# EAGLE design logicBlocks-AND (EAGLE 6.2)
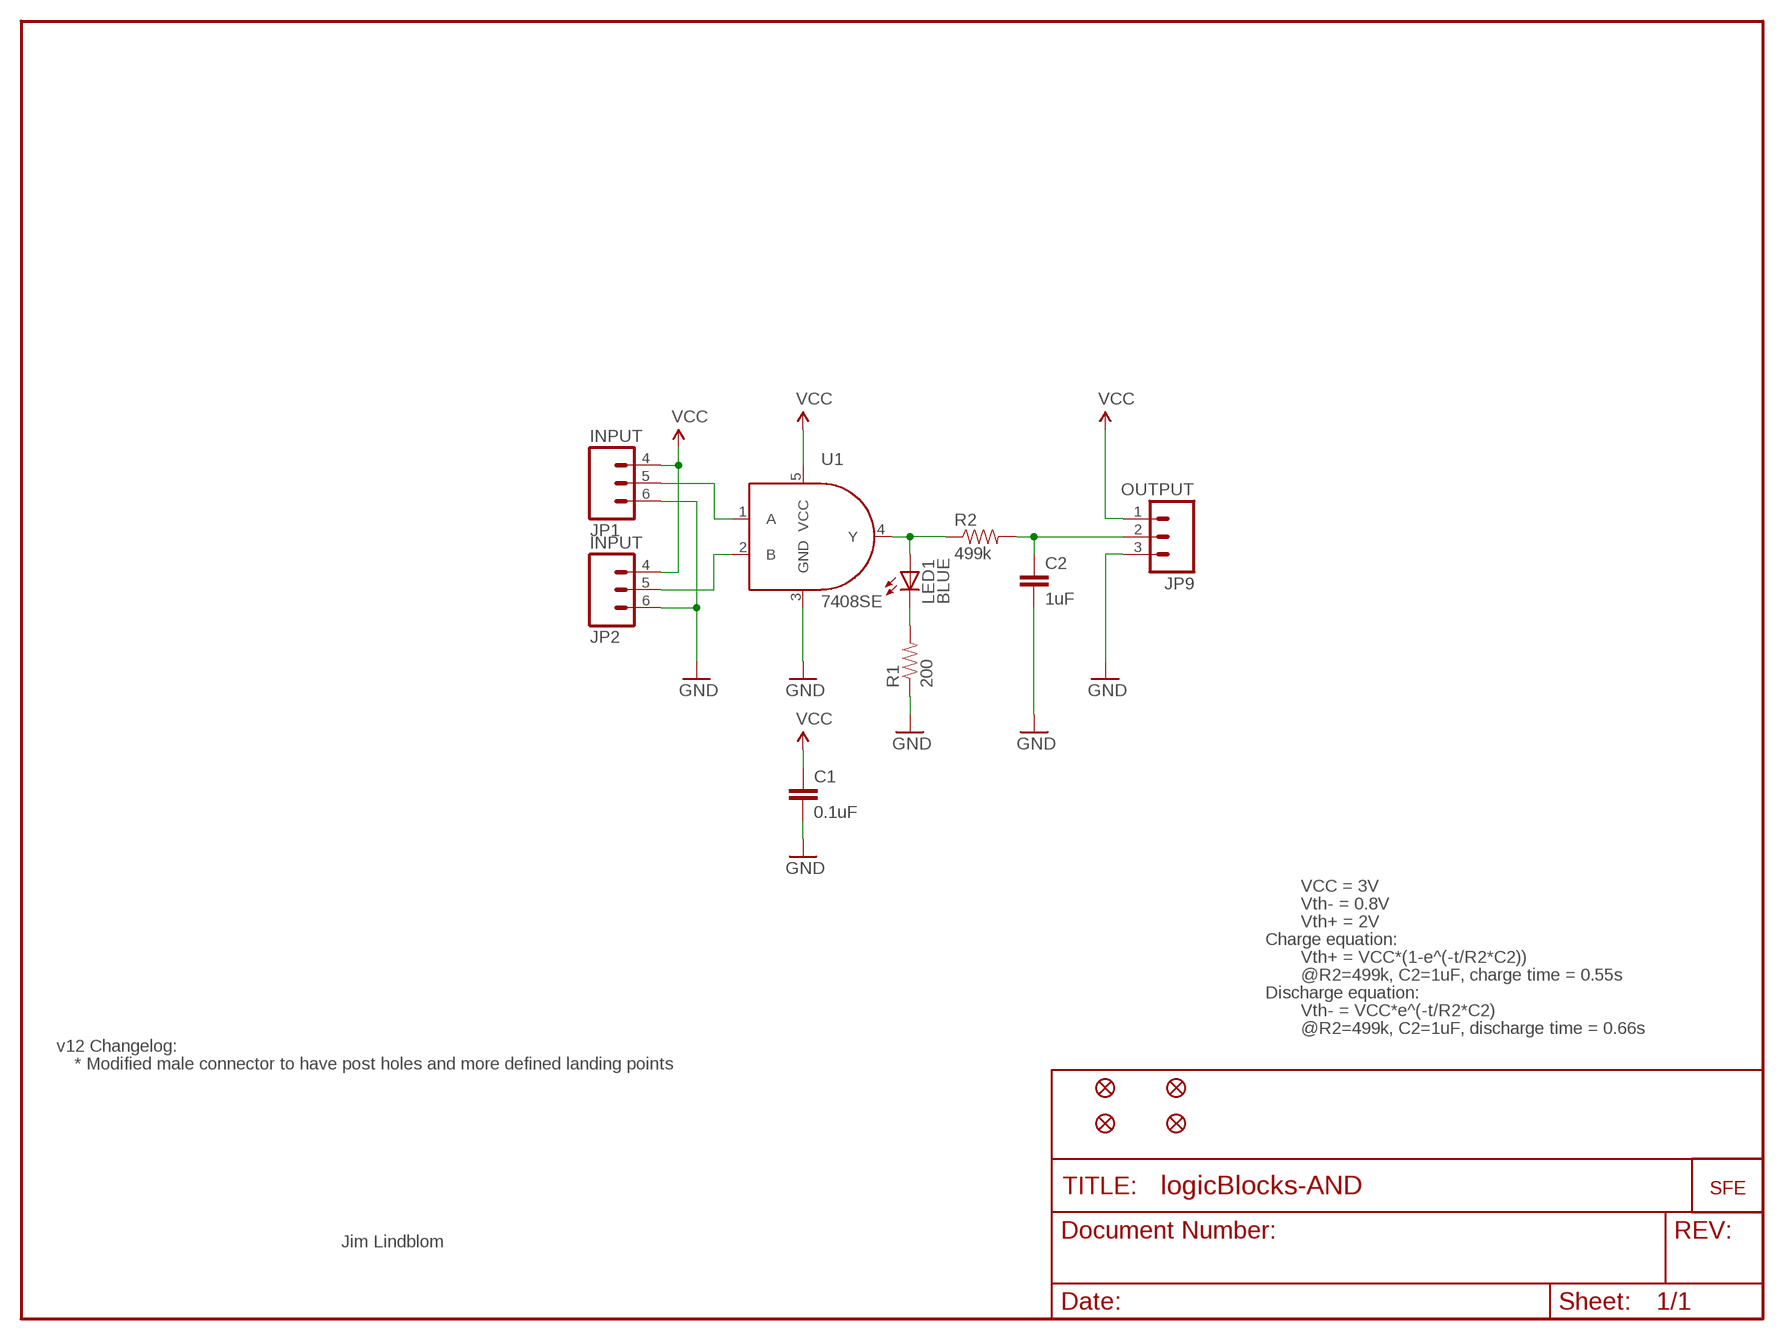
[diagram p0: schematic, sheet 1]

## Parts
C1  0.1uF  CAP0402-CAP  [0402-CAP]
C2  1uF  CAP0402-CAP  [0402-CAP]
JP1  INPUT  M03SMD-RA-FEMALE  [1X03-SMD-FEMALE]
JP2  INPUT  M03SMD-RA-FEMALE  [1X03-SMD-FEMALE]
JP4  FIDUCIALUFIDUCIAL  [MICRO-FIDUCIAL]
JP5  LOGO-SFESK  [SFE-LOGO-FLAME]
JP6  FIDUCIALUFIDUCIAL  [MICRO-FIDUCIAL]
JP7  FIDUCIALUFIDUCIAL  [MICRO-FIDUCIAL]
JP8  FIDUCIALUFIDUCIAL  [MICRO-FIDUCIAL]
JP9  OUTPUT  M03SMD_RA_MALE_POST  [1X03_SMD_RA_MALE_POST]
LED1  BLUE  LED1206  [LED-1206]
R1  200  RESISTOR0402-RES  [0402-RES]
R2  499k  RESISTOR0402-RES  [0402-RES]
U1  7408SE  [SOT353]

## Nets
GND: C1.2 C2.2 JP1.6 JP2.6 JP9.3 R1.1 U1.3(GND)
N$1: JP1.5 U1.1(A)
N$2: JP2.5 U1.2(B)
N$3: C2.1 JP9.2 R2.2
N$4: LED1.A R2.1 U1.4(Y)
N$5: LED1.C R1.2
VCC: C1.1 JP1.4 JP2.4 JP9.1 U1.5(VCC)

## Notes on the sheet
- VCC = 3V
- Vth- = 0.8V
- Vth+ = 2V
- Charge equation:
- Vth+ = VCC*(1-e^(-t/R2*C2))
- @R2=499k, C2=1uF, charge time = 0.55s
- Discharge equation:
- Vth- = VCC*e^(-t/R2*C2)
- @R2=499k, C2=1uF, discharge time = 0.66s
- v12 Changelog:
- * Modified male connector to have post holes and more defined landing points
- Jim Lindblom

## Library data of the parts
C1 C2 = SparkFun:CAP: Capacitor Standard 0603 ceramic capacitor, and 0.1" leaded capacitor.
JP1 JP2 = SparkFun:M03: Header 3 Standard 3-pin 0.1" header. Use with straight break away headers (SKU : PRT-00116), right angle break away headers (PRT-00553), swiss pins (PRT-00743), machine pins (PRT-00117), and female headers (PRT-00115). Molex polarized connector foot print use with SKU : PRT-08232 with associated crimp pins and housings.
JP4 JP6-JP8 = SparkFun:FIDUCIAL: Fiducial Alignment Points Various fiducial points for machine vision alignment.
JP5 = SparkFun:LOGO-SFE: Spark Fun Electronics PCB Logo This is the standard Spark Fun Electronics PCB logo.
JP9 = SparkFun-Connectors:M03: Header 3 Standard 3-pin 0.1" header. Use with straight break away headers (SKU : PRT-00116), right angle break away headers (PRT-00553), swiss pins (PRT-00743), machine pins (PRT-00117), and female headers (PRT-00115). Molex polarized connector foot print use with SKU : PRT-08232 with associated crimp pins and housings.
LED1 = SparkFun:LED: LEDs Standard schematic elements and footprints for 5mm, 3mm, 1206, and 0603 sized LEDs. 5mm - Spark Fun Electronics SKU : COM-00529 (and others)
R1 R2 = SparkFun:RESISTOR: Resistor Basic schematic elements and footprints for 0603, 1206, and PTH resistors.
U1 = SparkFun:74*08

## Board
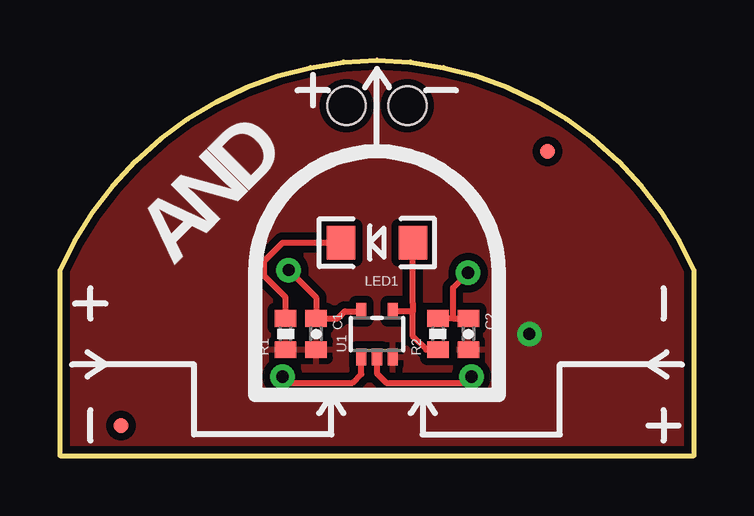
[diagram p1: board, top side]
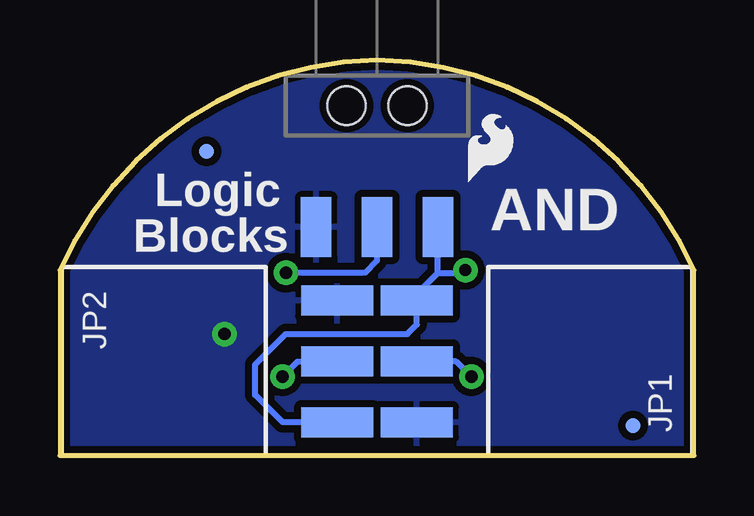
[diagram p2: board, bottom side, seen from below]

Size 26.42 x 16.51 mm. Coordinates in mm from the lower left corner, seen from the top.
Outline: 0,0 0,7.75 arc-65 13.21,16.51 arc-65 26.42,7.75 26.42,0 0,0
Copper layers (1*16): Top 0.035mm / dielectric 1.5mm / Bottom 0.035mm
Design rules: minimum track width 8mil, minimum drill 20mil, track to track 8mil, track to pad 8mil, pad to pad 8mil, via to via 8mil, smd to smd 8mil, copper to edge 8mil, drill to drill 8mil, minimum pad ring 12mil, minimum via ring 10mil, stop-mask expansion 4mil, vias tented up to drill 20mil, thermal gap 10mil

### Footprints (pad centres in the part's own frame; a part is rotated, then mirrored left to right if it is on the bottom)
0402-CAP = smd 0.7 x 0.9: 1 -0.65,0; 2 0.65,0
1X03-SMD-FEMALE = smd 1.25 x 3: 4 2.54,7.225; 5 0,7.225; 6 -2.54,7.225
MICRO-FIDUCIAL = smd 0.635 x 0.635: 1 0,0
1X03_SMD_RA_MALE_POST = smd 1.27 x 2.5: 1 -2.54,5.07; 2 0,5.07; 3 2.54,5.07 | hole 1.6: -1.27,0; 1.27,0
LED-1206 = smd 1.2 x 1.4: A -1.5,0; C 1.5,0
0402-RES = smd 0.7 x 0.9: 1 -0.65,0; 2 0.65,0
SOT353 = smd 0.42 x 0.7: 1 -0.65,-0.95; 2 0,-0.95; 3 0.65,-0.95; 4 0.65,0.95; 5 -0.65,0.95

### Placement (x,y rotation side)
C1  10.67,5.08 270 top
C2  17.02,5.08 270 top
JP1  4.32,3.94 90 bottom
JP2  22.1,3.94 270 bottom
JP4  2.54,1.27 0 bottom
JP5  9.4,11.43 0 bottom
JP6  20.32,12.7 0 bottom
JP7  2.54,1.27 0 top
JP8  20.32,12.7 0 top
JP9  13.21,14.61 180 bottom
LED1  13.21,8.89 180 top
R1  9.4,5.08 90 top
R2  15.75,5.08 90 top
U1  13.21,5.08 0 top

### Tracks (layer width: path | path; a pad name or v marks a point on that pad's centre or on a via)
GND  (via drill 0.51)
  other vias: 19.56,5.08
  pour Bottom (isolate 0.305): 0,0 0,7.75 arc-65 13.21,16.51 arc-65 26.42,7.75 26.42,0
  pour Top (isolate 0.305): 0,0 0,7.75 arc-65 13.21,16.51 arc-65 26.42,7.75 26.42,0
N$1  (via drill 0.51)
  Top 0.254: U1.1 12.56,3.41 12.19,3.05 9.53,3.05 v9.27,3.3
  Bottom 0.254: JP1.5 9.91,3.94 v9.27,3.3
N$2  (via drill 0.51)
  Top 0.254: U1.2 13.21,3.43 13.59,3.05 16.89,3.05 v17.14,3.3
  Bottom 0.254: JP2.5 16.51,3.94 v17.14,3.3
N$3  (via drill 0.51)
  Top 0.254: 16.37,5.73 R2.2 | 16.37,5.73 16.37,7 v17,7.63 | 16.37,5.73 C2.1
  Bottom 0.254: v17,7.63 13.7,7.63 13.21,8.13 JP9.2
N$4
  Top 0.254: R2.1 15.26,4.43 14.71,4.98 14.71,6.03 | LED1.A 14.71,6.35 14.71,6.03 | 14.71,6.03 U1.4
N$5
  Top 0.254: LED1.C 9.27,8.89 8.51,8.13 8.51,7.49 9.4,6.6 R1.2
VCC  (via drill 0.51)
  Top 0.254: U1.5 11.87,6.03 11.57,5.73 C1.1 10.67,6.6 v9.53,7.75
  Bottom 0.254: JP2.4 17.14,1.4 18.29,2.54 18.29,3.81 17.02,5.08 11.94,5.08 11.54,5.47 JP1.4 11.54,6.75 10.67,7.62 | 10.67,7.62 9.65,7.62 v9.53,7.75 | 10.67,7.62 JP9.1

### Text on the board
tPlace: D | N | A
bPlace: Logic | AND | Blocks